# EAGLE schematic beercooler (EAGLE 6.4)
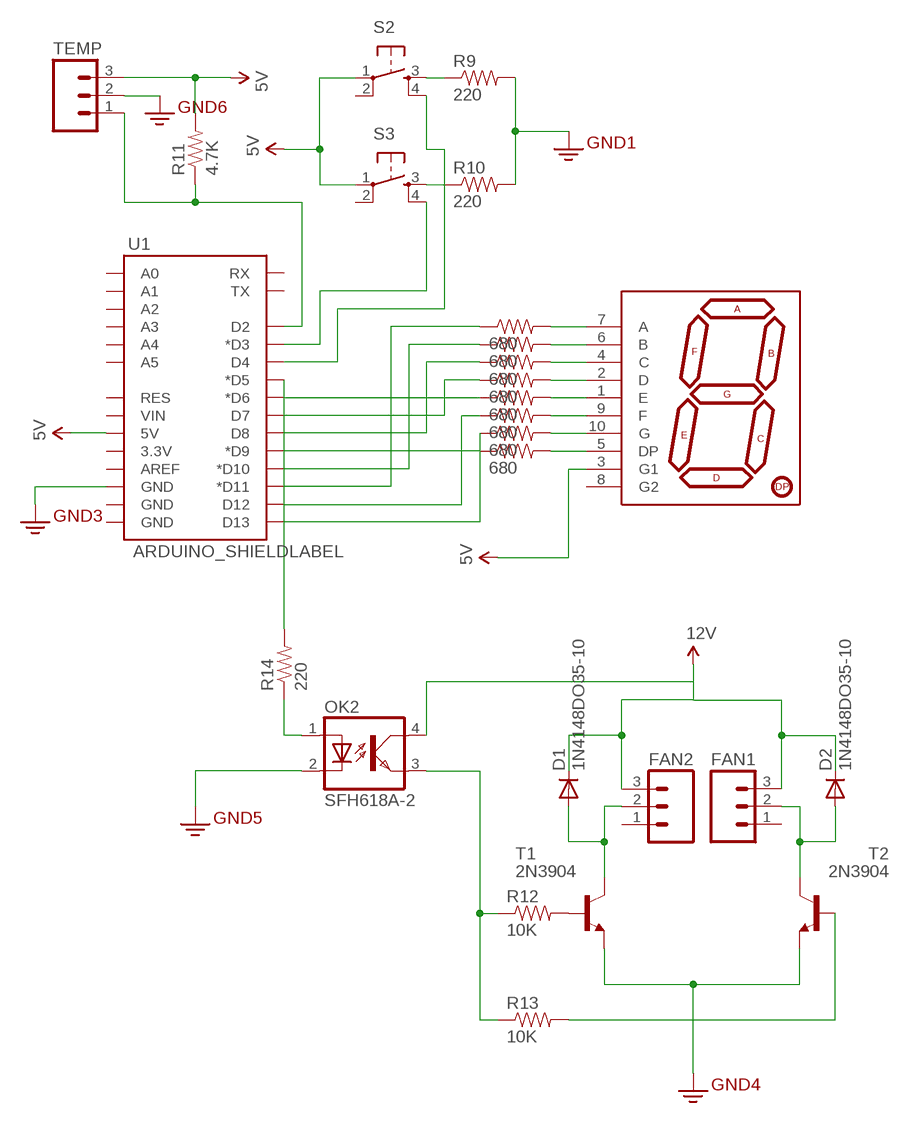
[diagram p0: schematic, sheet 1]

## Parts
D1  1N4148DO35-10  [DO35-10]
D2  1N4148DO35-10  [DO35-10]
FAN1  M03POLAR  [MOLEX-1X3]
FAN2  M03POLAR  [MOLEX-1X3]
OK2  SFH618A-2  [DIP4]
R1  680  RESISTORPTH-1/4W  [AXIAL-0.4]
R2  680  RESISTORPTH-1/4W  [AXIAL-0.4]
R3  680  RESISTORPTH-1/4W  [AXIAL-0.4]
R4  680  RESISTORPTH-1/4W  [AXIAL-0.4]
R5  680  RESISTORPTH-1/4W  [AXIAL-0.4]
R6  680  RESISTORPTH-1/4W  [AXIAL-0.4]
R7  680  RESISTORPTH-1/4W  [AXIAL-0.4]
R8  680  RESISTORPTH-1/4W  [AXIAL-0.4]
R9  220  RESISTORPTH-1/4W  [AXIAL-0.4]
R10  220  RESISTORPTH-1/4W  [AXIAL-0.4]
R11  4.7K  RESISTORPTH-1/4W  [AXIAL-0.4]
R12  10K  RESISTORPTH-1/4W  [AXIAL-0.4]
R13  10K  RESISTORPTH-1/4W  [AXIAL-0.4]
R14  220  RESISTORPTH-1/4W  [AXIAL-0.4]
S2  TAC_SWITCHPTH  [TACTILE-PTH]
S3  TAC_SWITCHPTH  [TACTILE-PTH]
T1  2N3904  [TO92]
T2  2N3904  [TO92]
TEMP  M03POLAR  [MOLEX-1X3]
U1  ARDUINO_SHIELDLABEL  [DUEMILANOVE_SHIELD]
U$1  7-SEGMENT-DISPLAY-1"-RED  [7-SEGMENT-1"PTH]

## Nets
3.3V: D1.C D2.C FAN1.3 FAN2.3 OK2.2(C) OK2.4(COL) T1.3(E) T2.3(E) TEMP.2 U1.GND@2(GND) ; supply symbol labelled GND2, 12V
5V: R11.P$2 S2.1 S3.1 TEMP.3 U1.5V U$1.3(G1)
N$1: R1.P$2 U$1.7(A)
N$2: R2.P$2 U$1.6(B)
N$3: R3.P$2 U$1.4(C)
N$4: R4.P$2 U$1.2(D)
N$5: R5.P$2 U$1.1(E)
N$6: R6.P$2 U$1.9(F)
N$7: R7.P$2 U$1.10(G)
N$8: R8.P$2 U$1.5(DP)
N$9: R5.P$1 U1.D6(*D6)
N$10: R4.P$1 U1.D7
N$11: R3.P$1 U1.D8
N$12: R8.P$1 U1.D9(*D9)
N$13: R2.P$1 U1.D10(*D10)
N$14: R1.P$1 U1.D11(*D11)
N$15: R6.P$1 U1.D12
N$16: R7.P$1 U1.D13
N$17: R10.P$1 S3.3
N$18: R9.P$1 S2.3
N$19: R9.P$2 R10.P$2 ; supply symbol labelled GND2
N$20: S3.4 U1.D3(*D3)
N$21: S2.4 U1.D4
N$23: D2.A FAN1.2
N$24: R11.P$1 U1.D2
N$25: R14.P$2 U1.D5(*D5)
N$26: D1.A FAN2.2 T1.1(C)
N$27: OK2.1(A) R14.P$1
N$28: R13.P$2 T2.2(B)
N$29: R12.P$2 T1.2(B)
N$31: OK2.3(EMIT) R12.P$1 R13.P$1
Unconnected: FAN1.1 FAN2.1 S2.2 S3.2 T2.1(C) TEMP.1 U1.3.3V U1.A0 U1.A1 U1.A2 U1.A3 U1.A4 U1.A5 U1.AREF U1.GND@0(GND) U1.GND@1(GND) U1.RES U1.RX U1.TX U1.VIN U$1.8(G2)

## Library data of the parts
D1 D2 = diode:1N4148: DIODE high speed (Philips)
FAN1 FAN2 TEMP = SparkFun-Connectors:M03: Header 3 Standard 3-pin 0.1" header. Use with straight break away headers (SKU : PRT-00116), right angle break away headers (PRT-00553), swiss pins (PRT-00743), machine pins (PRT-00117), and female headers (PRT-00115). Molex polarized connector foot print use with SKU : PRT-08232 with associated crimp pins and housings.
OK2 = optocoupler:SFH618?*: Optocoupler, Phototransistor Output, Low Input Current Source: Data sheet <http://www.vishay.com/docs/83673/sfh618.pdf>; MF: VISHAY/TELEFUNKEN; MPN: SFH618A-2; OC_FARNELL: 6424855; OC_NEWARK: 21H7744
R1-R14 = SparkFun-Resistors:RESISTOR: Resistor Basic schematic elements and footprints for 0603, 1206, and PTH resistors.
S2 S3 = SparkFun-Electromechanical:TAC_SWITCH: Momentary Switch Button commonly used for reset or general input. Spark Fun Electronics SKU : COM-00097 SMT- SWCH-08247
T1 T2 = transistor:2N3904: NPN TRANSISTOR
U1 = SparkFun-Boards:ARDUINO_SHIELD: Arduino shield footprint
U$1 = SparkFun-Displays:7-SEGMENT-DISPLAY-1"-RED: 7-Segment Display 1" Red (COM-08546)